# EAGLE schematic Croduino Basic v1.2 (EAGLE 7.3.0)
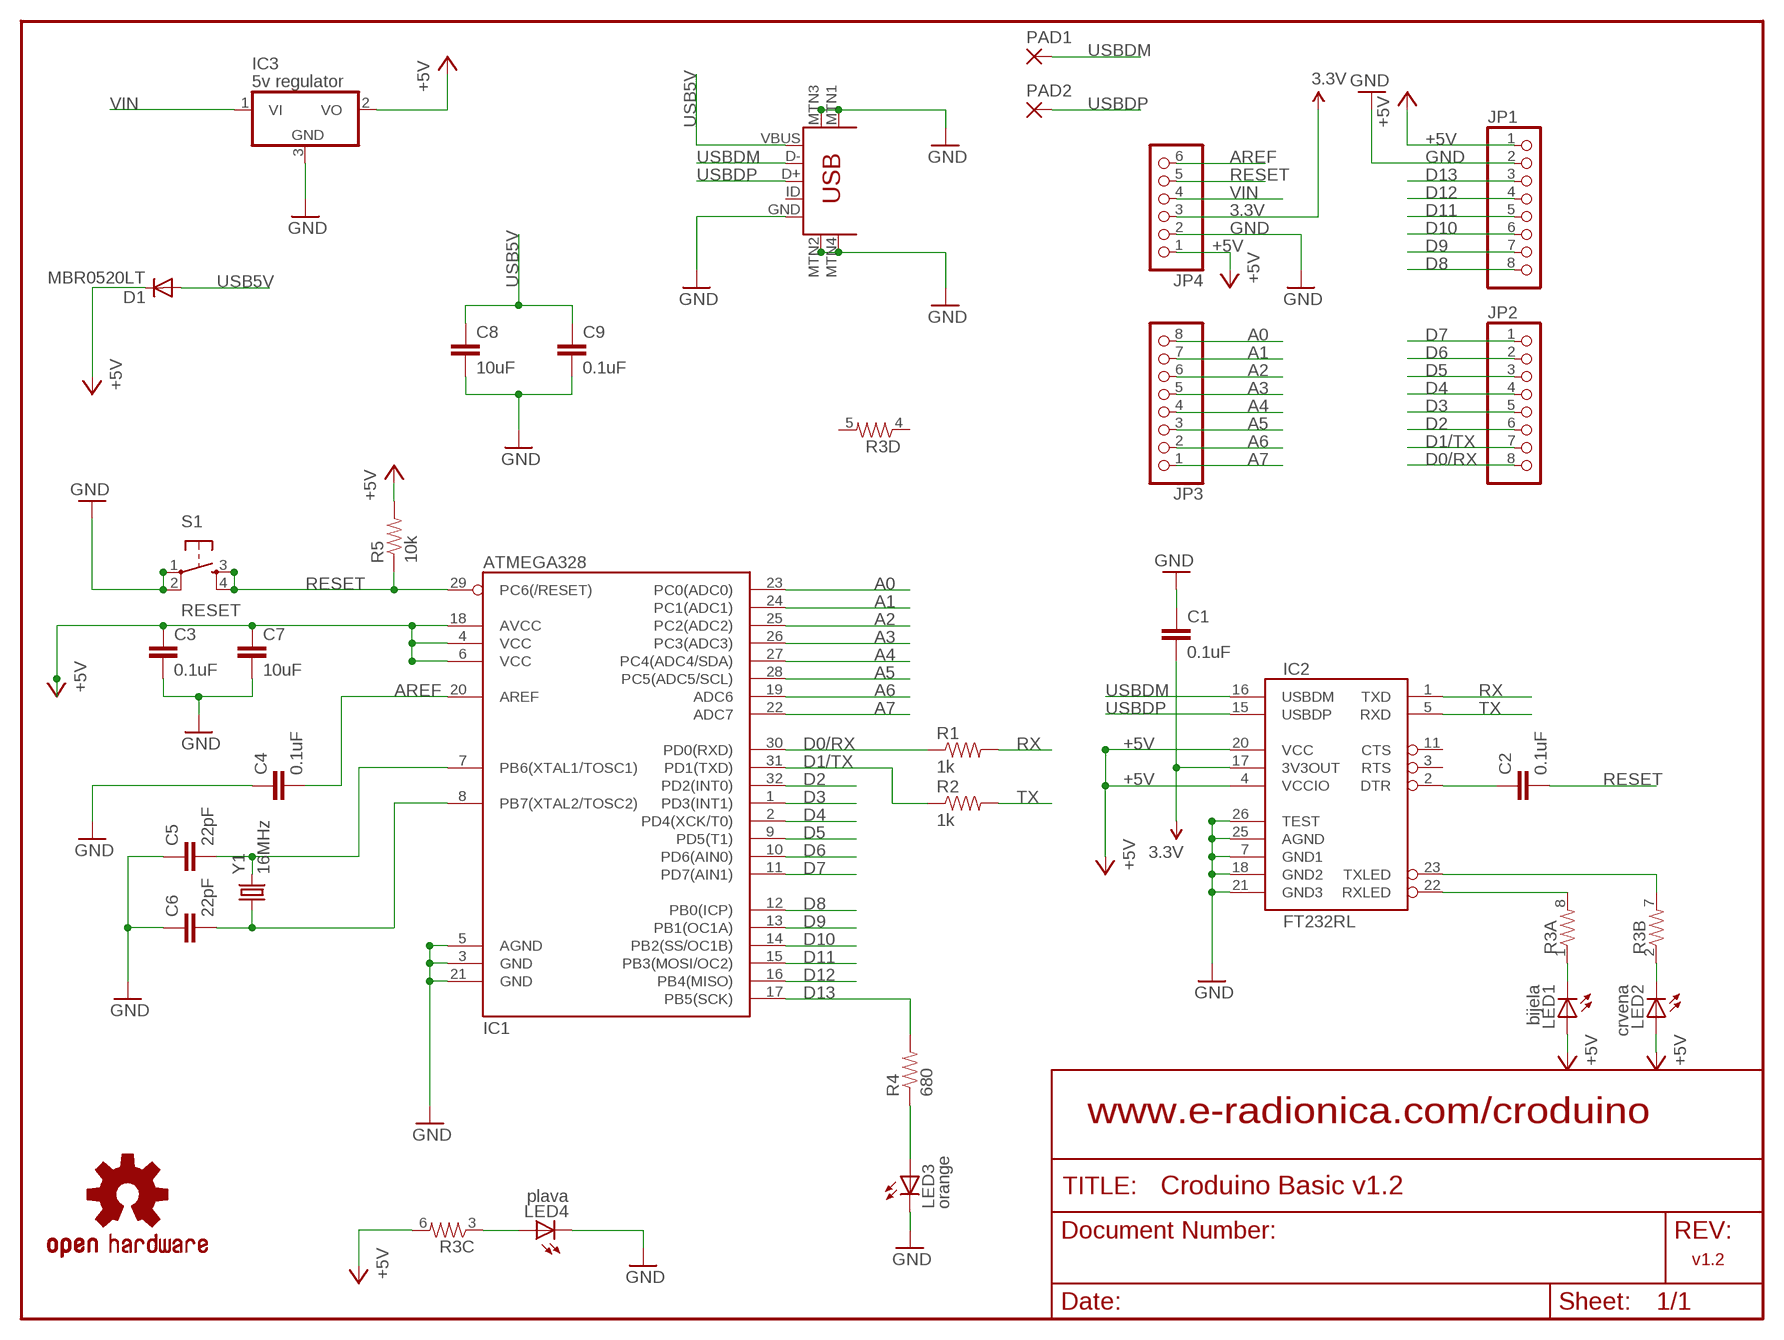
[diagram p0: schematic, sheet 1]

## Parts
C1  0.1uF  CAP0603-CAP  [0603-CAP]
C2  0.1uF  CAP0603-CAP  [0603-CAP]
C3  0.1uF  CAP0603-CAP  [0603-CAP]
C4  0.1uF  CAP0603-CAP  [0603-CAP]
C5  22pF  CAP0603-CAP  [0603-CAP]
C6  22pF  CAP0603-CAP  [0603-CAP]
C7  10uF  C-EUC3216  [C3216]
C8  10uF  C-EUC3216  [C3216]
C9  0.1uF  CAP0603-CAP  [0603-CAP]
D1  MBR0520LT  [SOD123]
IC1  ATMEGA328  ATMEGA168  [TQFP32-08]
IC2  FT232RL  FT232RL-BASICSSOP  [SSOP28DB]
IC3  5v regulator  7805DT  [TO252]
JP1  PINHD-1X8BIG  [1X08-BIG]
JP2  PINHD-1X8BIG  [1X08-BIG]
JP3  PINHD-1X8BIG  [1X08-BIG]
JP4  PINHD-1X6B  [1X06-BIG]
LED1  bijela  LEDCHIP-LED0805  [CHIP-LED0805]
LED2  crvena  LEDCHIP-LED0805  [CHIP-LED0805]
LED3  orange  LEDCHIP-LED0805  [CHIP-LED0805]
LED4  plava  LEDCHIP-LED0805  [CHIP-LED0805]
PAD1  SMD2  [SMD1,27-2,54]
PAD2  SMD2  [SMD1,27-2,54]
R1  1k  RESISTOR0603-RES  [0603-RES]
R2  1k  RESISTOR0603-RES  [0603-RES]
R3  RESISTOR-ARRAY0603-ARV  [0603-ARV]
R4  680  RESISTOR0603-RES  [0603-RES]
R5  10k  RESISTOR0603-RES  [0603-RES]
S1  RESET  TAC_SWITCHSMD  [TACTILE_SWITCH_SMD]
U1  USB-MINIB  USB-MINIB-5PIN  [USB-MINIB]
U$5  OSHW-LOGOS  [OSHW-LOGO-S]
Y1  16MHz  CRYSTAL5X3  [CRYSTAL-SMD-5X3]

## Nets
3.3V: C1.2 IC2.17(3V3OUT) JP4.3
+5V: C3.1 C7.1 D1.C IC1.4(VCC) IC1.6(VCC) IC1.18(AVCC) IC2.4(VCCIO) IC2.20(VCC) IC3.2(VO) JP1.1 JP4.1 LED1.A LED2.A R3.6 R5.2
A0: IC1.23(PC0(ADC0)) JP3.8
A1: IC1.24(PC1(ADC1)) JP3.7
A2: IC1.25(PC2(ADC2)) JP3.6
A3: IC1.26(PC3(ADC3)) JP3.5
A4: IC1.27(PC4(ADC4/SDA)) JP3.4
A5: IC1.28(PC5(ADC5/SCL)) JP3.3
A6: IC1.19(ADC6) JP3.2
A7: IC1.22(ADC7) JP3.1
AREF: C4.2 IC1.20(AREF) JP4.6
CRYSTAL1: C5.2 IC1.7(PB6(XTAL1/TOSC1)) Y1.3
CRYSTAL2: C6.2 IC1.8(PB7(XTAL2/TOSC2)) Y1.1
D0/RX: IC1.30(PD0(RXD)) JP2.8 R1.1
D1/TX: IC1.31(PD1(TXD)) JP2.7 R2.1
D2: IC1.32(PD2(INT0)) JP2.6
D3: IC1.1(PD3(INT1)) JP2.5
D4: IC1.2(PD4(XCK/T0)) JP2.4
D5: IC1.9(PD5(T1)) JP2.3
D6: IC1.10(PD6(AIN0)) JP2.2
D7: IC1.11(PD7(AIN1)) JP2.1
D8: IC1.12(PB0(ICP)) JP1.8
D9: IC1.13(PB1(OC1A)) JP1.7
D10: IC1.14(PB2(SS/OC1B)) JP1.6
D11: IC1.15(PB3(MOSI/OC2)) JP1.5
D12: IC1.16(PB4(MISO)) JP1.4
D13: IC1.17(PB5(SCK)) JP1.3 R4.2
GND: C1.1 C3.2 C4.1 C5.1 C6.1 C7.2 C8.2 C9.2 IC1.3(GND) IC1.5(AGND) IC1.21(GND) IC2.7(GND1) IC2.18(GND2) IC2.21(GND3) IC2.25(AGND) IC2.26(TEST) IC3.3(GND) JP1.2 JP4.2 LED3.C LED4.C S1.1 S1.2 U1.GND U1.MTN1(MTN2) U1.MTN2(MTN3) U1.MTN3(MTN1) U1.MTN4
N$1: LED1.C R3.1
N$2: LED2.C R3.2
N$3: C2.1 IC2.2(DTR)
N$4: LED3.A R4.1
N$7: LED4.A R3.3
RESET: C2.2 IC1.29(PC6(/RESET)) JP4.5 R5.1 S1.3 S1.4
RX: IC2.1(TXD) R1.2
RXLED: IC2.22(RXLED) R3.8
TX: IC2.5(RXD) R2.2
TXLED: IC2.23(TXLED) R3.7
USB5V: C8.1 C9.1 D1.A U1.VBUS
USBDM: IC2.16(USBDM) PAD1.1(P) U1.D-
USBDP: IC2.15(USBDP) PAD2.1(P) U1.D+
VIN: IC3.1(VI) JP4.4
Unconnected: IC2.3(RTS) IC2.11(CTS) R3.4 R3.5 U1.ID

## Notes on the sheet
- www.e-radionica.com/croduino
- v1.2

## Library data of the parts
C1-C6 C9 = SparkFun:CAP: Capacitor Standard 0603 ceramic capacitor, and 0.1" leaded capacitor.
C7 C8 = rcl:C-EU: CAPACITOR, European symbol
D1 = diode:MBR0520LT: SCHOTTKY BARRIER RECTIFIER Source: http://onsemi.com .. MBR0520LT1-D.pdf
IC1 = SparkFun:ATMEGA168
IC2 = SparkFun:FT232RL-BASIC: USB UART This is the simplified version of the FT232RL unit. Only what you need, nothing you don't. Spark Fun Electronics SKU : COM-00650
IC3 = adafruit:78*: Positive VOLTAGE REGULATOR Added bigger pads to the TO-92 package
JP1-JP3 = adafruit:PINHD-1X8: PIN HEADER
JP4 = adafruit:PINHD-1X6: PIN HEADER
LED1-LED4 = adafruit:LED: LED OSRAM: - CHIPLED LG R971, LG N971, LY N971, LG Q971, LY Q971, LO R971, LY R971 LH N974, LH R974 LS Q976, LO Q976, LY Q976 LO Q996 - Hyper CHIPLED LW Q18S LB Q993, LB Q99A, LB R99A - SideLED LS A670, LO A670, LY A670, LG A670, LP A670 LB A673, LV A673, LT A673, LW A673 LH A674 LY A675 LS A676, LA A676, LO A676, LY A676, LW A676 LS A679, LY A679, LG A679 - Hyper Micro SIDELED® LS Y876, LA Y876, LO Y876, LY Y876 LT Y87S - SmartLED LW L88C, LW L88S LB L89C, LB L89S, LG L890 LS L89K, LO L89K, LY L89K LS L896, LA L896, LO L896, LY L896 - TOPLED LS T670, LO T670, LY T670, LG T670, LP T670 LSG T670, LSP T670, LSY T670, LOP T670, LYG T670 LG T671, LOG T671, LSG T671 LB T673, LV T673, LT T673, LW T673 LH T674 LS T676, LA T676, LO T676, LY T676, LB T676, LH T676, LSB T676, LW T676 LB T67C, LV T67C, LT T67C, LS T67K, LO T67K, LY T67K, LW E67C LS E67B, LA E67B, LO E67B, LY E67B, LB E67C, LV E67C, LT E67C LW T67C LS T679, LY T679, LG T679 LS T770, LO T770, LY T770, LG T770, LP T770 LB T773, LV T773, LT T773, LW T773 LH T774 LS E675, LA E675, LY E675, LS T675 LS T776, LA T776, LO T776, LY T776, LB T776 LHGB T686 LT T68C, LB T68C - Hyper Mini TOPLED® LB M676 - Mini TOPLED Santana® LG M470 LS M47K, LO M47K, LY M47K Source: http://www.osram.convergy.de/
PAD1 PAD2 = wirepad:SMD2: SMD PAD
R1 R2 R4 R5 = SparkFun:RESISTOR: Resistor Basic schematic elements and footprints for 0603, 1206, and PTH resistors.
R3 = SparkFun:RESISTOR-ARRAY: Array Chip Resistor Source: RS Component / Phycomp
S1 = SparkFun:TAC_SWITCH: Momentary Switch Button commonly used for reset or general input. Spark Fun Electronics SKU : COM-00097
U1 = SparkFun:USB-MINIB: Mini-USB "B" connector with 5th pin broken out. Created new symbol breaking out 5th "ID" pin in mini/micro USB connector spec. See: http://en.wikipedia.org/wiki/Mini_usb#Cables. Uses same footprint as 4-pin symbol. Also added pins to connect to mounting / shield pads if required (probably not generally needed as signals aren't shielded once they leave the connector).
U$5 = SparkFun:OSHW-LOGO: Open Source Hardware Logo This logo indicates the piece of hardware it is found on incorporates a OSHW license and/or adheres to the definition of open source hardware found here: http://freedomdefined.org/OSHW
Y1 = SparkFun:CRYSTAL: Crystals Various standard crystals. Proven footprints. Spark Fun Electronics SKU : COM-00534